# Altium schematic sheet 充电.SchDoc
size A2
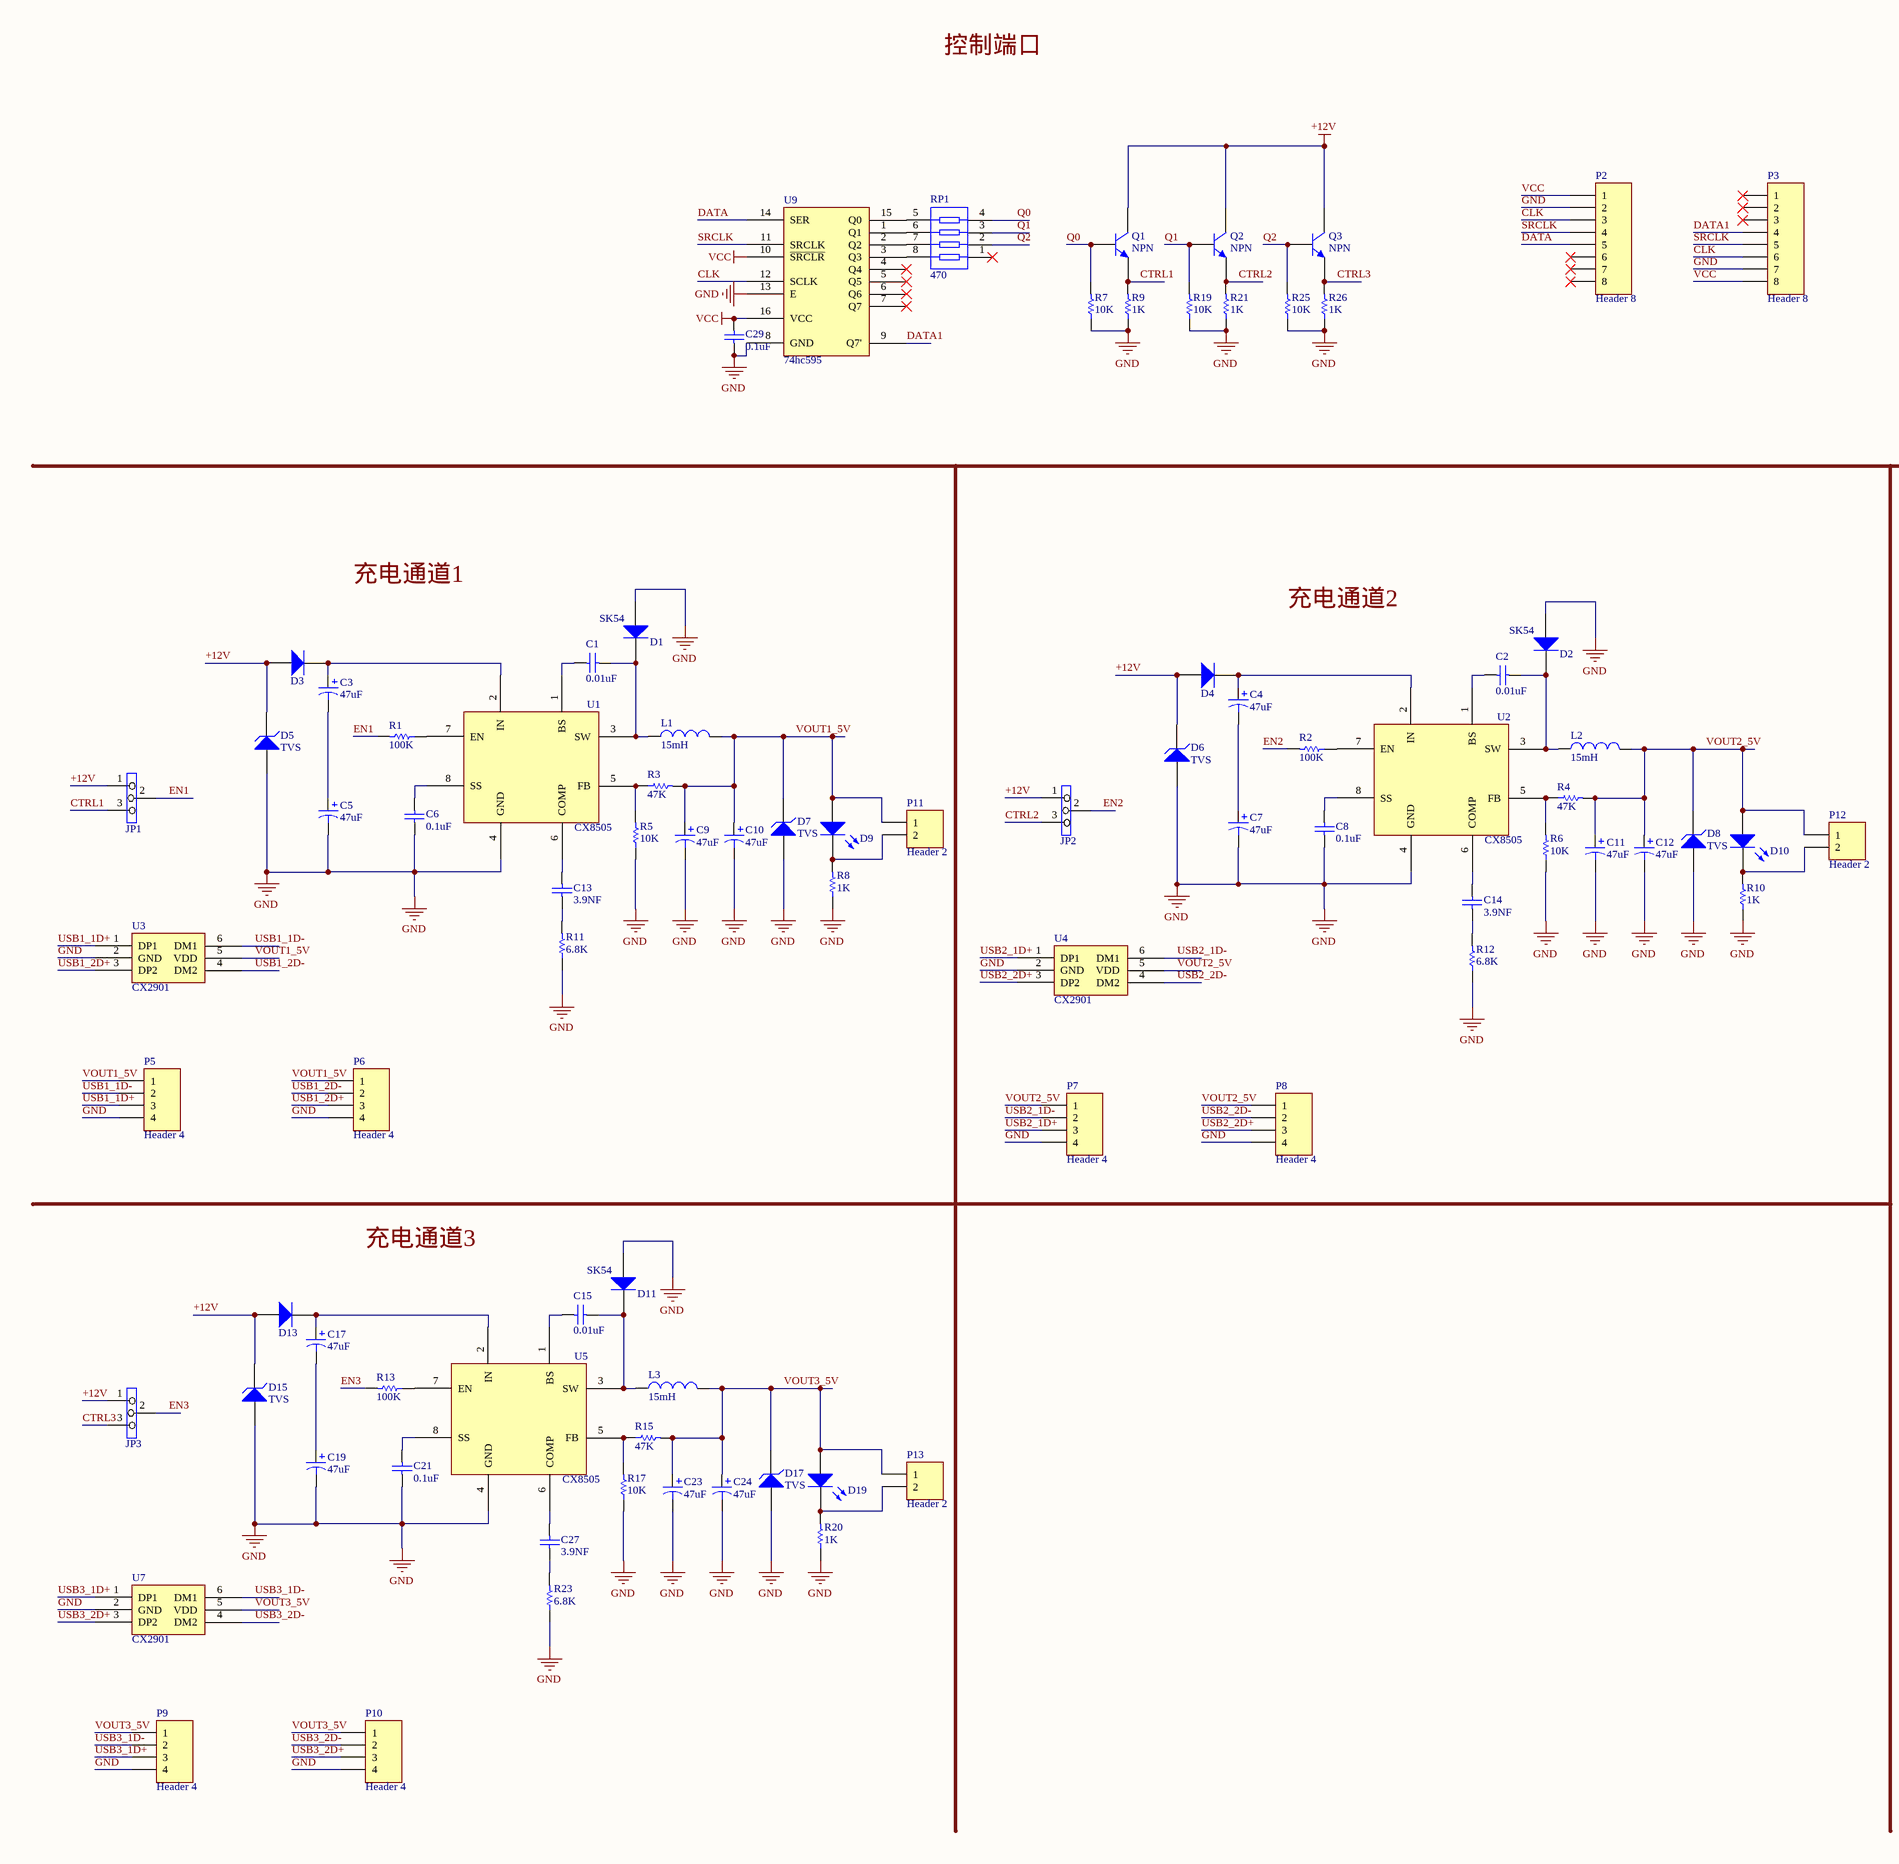
[diagram p0: 充电.SchDoc, left]
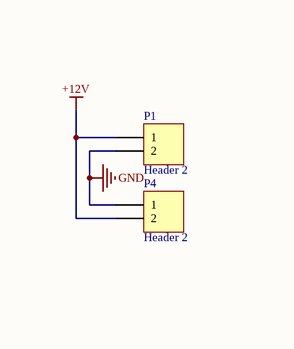
[diagram p1: 充电.SchDoc, right]

## Parts
C1  0.01uF  [CAPC2012M]
C2  0.01uF  [CAPC2012M]
C3  47uF  [CAPPR2-5x11.5]
C4  47uF  [CAPPR2-5x11.5]
C5  47uF  [CAPPR2-5x11.5]
C6  0.1uF  [CAPC2012M]
C7  47uF  [CAPPR2-5x11.5]
C8  0.1uF  [CAPC2012M]
C9  47uF  [CAPPR2-5x11.5]
C10  47uF  [CAPPR2-5x11.5]
C11  47uF  [CAPPR2-5x11.5]
C12  47uF  [CAPPR2-5x11.5]
C13  3.9NF  [CAPC2012M]
C14  3.9NF  [CAPC2012M]
C15  0.01uF  [CAPC2012M]
C17  47uF  [CAPPR2-5x11.5]
C19  47uF  [CAPPR2-5x11.5]
C21  0.1uF  [CAPC2012M]
C23  47uF  [CAPPR2-5x11.5]
C24  47uF  [CAPPR2-5x11.5]
C27  3.9NF  [CAPC2012M]
C29  0.1uF  [CAPC2012M]
D1  SK54  [SMC]
D2  SK54  [SMC]
D3  1N4007  [DSO-C2/X1.8]  (value not drawn)
D4  1N4007  [DSO-C2/X1.8]  (value not drawn)
D5  TVS  [SMB]
D6  TVS  [SMB]
D7  TVS  [DSO-C2/X1.8]
D8  TVS  [DSO-C2/X1.8]
D9  LED  [LED]  (value not drawn)
D10  LED  [LED]  (value not drawn)
D11  SK54  [SMC]
D13  1N4007  [DSO-C2/X1.8]  (value not drawn)
D15  TVS  [SMB]
D17  TVS  [DSO-C2/X1.8]
D19  LED  [LED]  (value not drawn)
JP1  Jumper3  [JP3]  (value not drawn)
JP2  Jumper3  [JP3]  (value not drawn)
JP3  Jumper3  [JP3]  (value not drawn)
L1  value 15mH  [15mh电感]  (hidden comment: Inductor)
L2  value 15mH  [15mh电感]  (hidden comment: Inductor)
L3  value 15mH  [15mh电感]  (hidden comment: Inductor)
P1  Header 2  [VH396-2]
P2  Header 8  [XH254-8]
P3  Header 8  [XH254-8]
P4  Header 2  [VH396-2]
P5  Header 4  [XH254-4]
P6  Header 4  [XH254-4]
P7  Header 4  [XH254-4]
P8  Header 4  [XH254-4]
P9  Header 4  [XH254-4]
P10  Header 4  [XH254-4]
P11  Header 2  [XH254-2]
P12  Header 2  [XH254-2]
P13  Header 2  [XH254-2]
Q1  NPN  [SOT23-3M]
Q2  NPN  [SOT23-3M]
Q3  NPN  [SOT23-3M]
R1  100K  [RESC2012M]
R2  100K  [RESC2012M]
R3  47K  [RESC2012M]
R4  47K  [RESC2012M]
R5  10K  [RESC2012M]
R6  10K  [RESC2012M]
R7  10K  [RESC2012M]
R8  1K  [RESC2012M]
R9  1K  [RESC2012M]
R10  1K  [RESC2012M]
R11  6.8K  [RESC2012M]
R12  6.8K  [RESC2012M]
R13  100K  [RESC2012M]
R15  47K  [RESC2012M]
R17  10K  [RESC2012M]
R19  10K  [RESC2012M]
R20  1K  [RESC2012M]
R21  1K  [RESC2012M]
R23  6.8K  [RESC2012M]
R25  10K  [RESC2012M]
R26  1K  [RESC2012M]
RP1  470  [EXB38V]
U1  CX8505  [SO8_M]
U2  CX8505  [SO8_M]
U3  CX2901  [SOT23_6L]
U4  CX2901  [SOT23_6L]
U5  CX8505  [SO8_M]
U7  CX2901  [SOT23_6L]
U9  74hc595  [SO16_M]

## Nets
+12V: D3.1(A) D4.1(A) D5.2(K) D6.2(K) D13.1(A) D15.2(K) JP1.1 JP2.1 JP3.1 P1.1 P4.2 Q1.3(C) Q2.3(C) Q3.3(C)
GND: C5.2 C6.1 C7.2 C8.1 C9.2 C10.2 C11.2 C12.2 C19.2 C21.1 C23.2 C24.2 C29.1 D1.2(A) D2.2(A) D5.1(A) D6.1(A) D7.1(A) D8.1(A) D11.2(A) D15.1(A) D17.1(A) P1.2 P2.2 P3.7 P4.1 P5.4 P6.4 P7.4 P8.4 P9.4 P10.4 R5.1 R6.1 R7.1 R8.1 R9.1 R10.1 R11.1 R12.1 R17.1 R19.1 R20.1 R21.1 R23.1 R25.1 R26.1 U1.4(GND) U2.4(GND) U3.2(GND) U4.2(GND) U5.4(GND) U7.2(GND) U9.8(GND) U9.13(E)
VCC: C29.2 P2.1 P3.8 U9.10(~{SRCLR}) U9.16(VCC)
CLK: P2.3 P3.6 U9.12(SCLK)
CTRL1: JP1.3 Q1.2(E) R9.2
CTRL2: JP2.3 Q2.2(E) R21.2
CTRL3: JP3.3 Q3.2(E) R26.2
DATA: P2.5 U9.14(SER)
DATA1: P3.4 U9.9(Q7')
EN1: JP1.2 R1.2
EN2: JP2.2 R2.2
EN3: JP3.2 R13.2
Q0: Q1.1(B) R7.2 RP1.4
Q1: Q2.1(B) R19.2 RP1.3
Q2: Q3.1(B) R25.2 RP1.2
SRCLK: P2.4 P3.5 U9.11(SRCLK)
USB1_1D+: P5.3 U3.1(DP1)
USB1_1D-: P5.2 U3.6(DM1)
USB1_2D+: P6.3 U3.3(DP2)
USB1_2D-: P6.2 U3.4(DM2)
USB2_1D+: P7.3 U4.1(DP1)
USB2_1D-: P7.2 U4.6(DM1)
USB2_2D+: P8.3 U4.3(DP2)
USB2_2D-: P8.2 U4.4(DM2)
USB3_1D+: P9.3 U7.1(DP1)
USB3_1D-: P9.2 U7.6(DM1)
USB3_2D+: P10.3 U7.3(DP2)
USB3_2D-: P10.2 U7.4(DM2)
VOUT1_5V: C9.1 C10.1 D7.2(K) D9.1(A) L1.2 P5.1 P6.1 P11.1 R3.2 U3.5(VDD)
VOUT2_5V: C11.1 C12.1 D8.2(K) D10.1(A) L2.2 P7.1 P8.1 P12.1 R4.2 U4.5(VDD)
VOUT3_5V: C23.1 C24.1 D17.2(K) D19.1(A) L3.2 P9.1 P10.1 P13.1 R15.2 U7.5(VDD)
NetC1_1: C1.1 D1.1(K) L1.1 U1.3(SW)
NetC1_2: C1.2 U1.1(BS)
NetC2_1: C2.1 D2.1(K) L2.1 U2.3(SW)
NetC2_2: C2.2 U2.1(BS)
NetC3_1: C3.1 D3.2(K) U1.2(IN)
NetC3_2: C3.2 C5.1
NetC4_1: C4.1 D4.2(K) U2.2(IN)
NetC4_2: C4.2 C7.1
NetC6_2: C6.2 U1.8(SS)
NetC8_2: C8.2 U2.8(SS)
NetC13_1: C13.1 R11.2
NetC13_2: C13.2 U1.6(COMP)
NetC14_1: C14.1 R12.2
NetC14_2: C14.2 U2.6(COMP)
NetC15_1: C15.1 D11.1(K) L3.1 U5.3(SW)
NetC15_2: C15.2 U5.1(BS)
NetC17_1: C17.1 D13.2(K) U5.2(IN)
NetC17_2: C17.2 C19.1
NetC21_2: C21.2 U5.8(SS)
NetC27_1: C27.1 R23.2
NetC27_2: C27.2 U5.6(COMP)
NetD9_2: D9.2(K) P11.2 R8.2
NetD10_2: D10.2(K) P12.2 R10.2
NetD19_2: D19.2(K) P13.2 R20.2
NetR1_1: R1.1 U1.7(EN)
NetR2_1: R2.1 U2.7(EN)
NetR3_1: R3.1 R5.2 U1.5(FB)
NetR4_1: R4.1 R6.2 U2.5(FB)
NetR13_1: R13.1 U5.7(EN)
NetR15_1: R15.1 R17.2 U5.5(FB)
NetRP1_5: RP1.5 U9.15(Q0)
NetRP1_6: RP1.6 U9.1(Q1)
NetRP1_7: RP1.7 U9.2(Q2)
NetRP1_8: RP1.8 U9.3(Q3)

Not connected (* = marked no-connect by the designer): P2 6* 7* 8*; P3 1* 2* 3*; RP1 1*; U9 4(Q4)* 5(Q5)* 6(Q6)* 7(Q7)*

## Notes on the sheet
- 控制端口
- 充电通道1
- 充电通道2
- 充电通道3

## Library data of the parts
C1 C2 C6 C8 C13-C15 C21 C27 C29 = Cap: Capacitor; Published: 8-Jun-2000; LatestRevisionDate: 17-Jul-2002; LatestRevisionNote: Re-released for DXP Platform.; PackageReference: RAD-0.3; Publisher: Altium Limited; PackageDescription: Radial Cap, Thru-Hole; 2 Leads; 0.3 in Pin Spacing
  C1 C2 C15: Value: 0.01uF
  C6 C8 C21 C29: Value: 0.1uF
  C13 C14 C27: Value: 3.9NF
C3-C5 C7 C9-C12 C17 C19 C23 C24 = Cap Pol2: Polarized Capacitor (22uf-47uf); Published: 8-Jun-2000; LatestRevisionDate: 17-Jul-2002; LatestRevisionNote: Re-released for DXP Platform.; Publisher: Altium Limited; PackageDescription: Polarized Capacitor; 2 Leads; Value: 47uF
D1 D2 D11 = Diode: Default Diode; Value: 1N4007; Published: 8-Jun-2000; LatestRevisionDate: 17-Jul-2002; LatestRevisionNote: Re-released for DXP Platform.; PackageVersion: Sep-1996; PackageReference: SMC; Publisher: Altium Limited; PackageDescription: DO-214-AB/SMC; 2 C-Bend Leads; Body 7.9 x 5.9 mm, inc. leads (LxW); Code_JEDEC: DO-214-AB
D3 D4 D13 = Diode: Default Diode; Published: 8-Jun-2000; LatestRevisionDate: 17-Jul-2002; LatestRevisionNote: Re-released for DXP Platform.; PackageVersion: Sep-1996; PackageReference: SMC; Publisher: Altium Limited; PackageDescription: DO-214-AB/SMC; 2 C-Bend Leads; Body 7.9 x 5.9 mm, inc. leads (LxW); Code_JEDEC: DO-214-AB; Value: 1N4007
D5-D8 D15 D17 = TVS: TVS瞬态抑制二极管; Published: 8-Jun-2000; LatestRevisionDate: 17-Jul-2002; LatestRevisionNote: Re-released for DXP Platform.; PackageReference: DIODE-0.7; Publisher: Altium Limited; PackageDescription: Diode, Thru-Hole; 2 Leads; 0.7 in Pin Spacing
D9 D10 D19 = LED: Typical INFRARED GaAs LED; Published: 8-Jun-2000; LatestRevisionDate: 08-Jul-2005; LatestRevisionNote: Mech Layer 1 removed.; PackageReference: LED-0; Publisher: Altium Limited; PackageDescription: LED; 2 Leads
L1-L3 = Inductor: Code_IEC: 1005; Published: 8-Jun-2000; LatestRevisionDate: 29-May-2009; LatestRevisionNote: IPC-7351 Footprint Added.; PackageReference: 0402-A; Publisher: Altium Limited; PackageDescription: Chip Inductor; Code_JEITA: 0402
P1 P4 P11-P13 = Header 2: Header, 2-Pin; LatestRevisionDate: 17-Jul-2002; LatestRevisionNote: Re-released for DXP Platform.; Publisher: Altium Limited
P2 P3 = Header 8: Header, 8-Pin; LatestRevisionDate: 17-Jul-2002; LatestRevisionNote: Re-released for DXP Platform.; Publisher: Altium Limited
P5-P10 = Header 4: Header, 4-Pin; LatestRevisionDate: 17-Jul-2002; LatestRevisionNote: Re-released for DXP Platform.; Publisher: Altium Limited
Q1-Q3 = NPN: NPN Bipolar Transistor; Published: 8-Jun-2000; LatestRevisionDate: 17-Jul-2002; LatestRevisionNote: Re-released for DXP Platform.; PackageReference: TO-226-AA; Publisher: Altium Limited; PackageDescription: TO, Flat Index; 3 In-Line, Axial Leads; Body Dia. 4.8mm; Leads 0.55 x 0.51 mm (max); Code_JEDEC: TO-226-AA
R1-R13 R15 R17 R19-R21 R23 R25 R26 = Res: Resistor; Published: 8-Jun-2000; LatestRevisionDate: 17-Jul-2002; LatestRevisionNote: Re-released for DXP Platform.; PackageReference: AXIAL-0.3; Publisher: Altium Limited; PackageDescription: Axial Device, Thru-Hole; 2 Leads; 0.3 in Pin Spacing
  R1 R2 R13: Value: 100K
  R3 R4 R15: Value: 47K
  R5-R7 R17 R19 R25: Value: 10K
  R8-R10 R20 R21 R26: Value: 1K
  R11 R12 R23: Value: 6.8K
RP1 = Res Pack: Value: 470